# EAGLE design ShiftRegController (EAGLE 6.2)
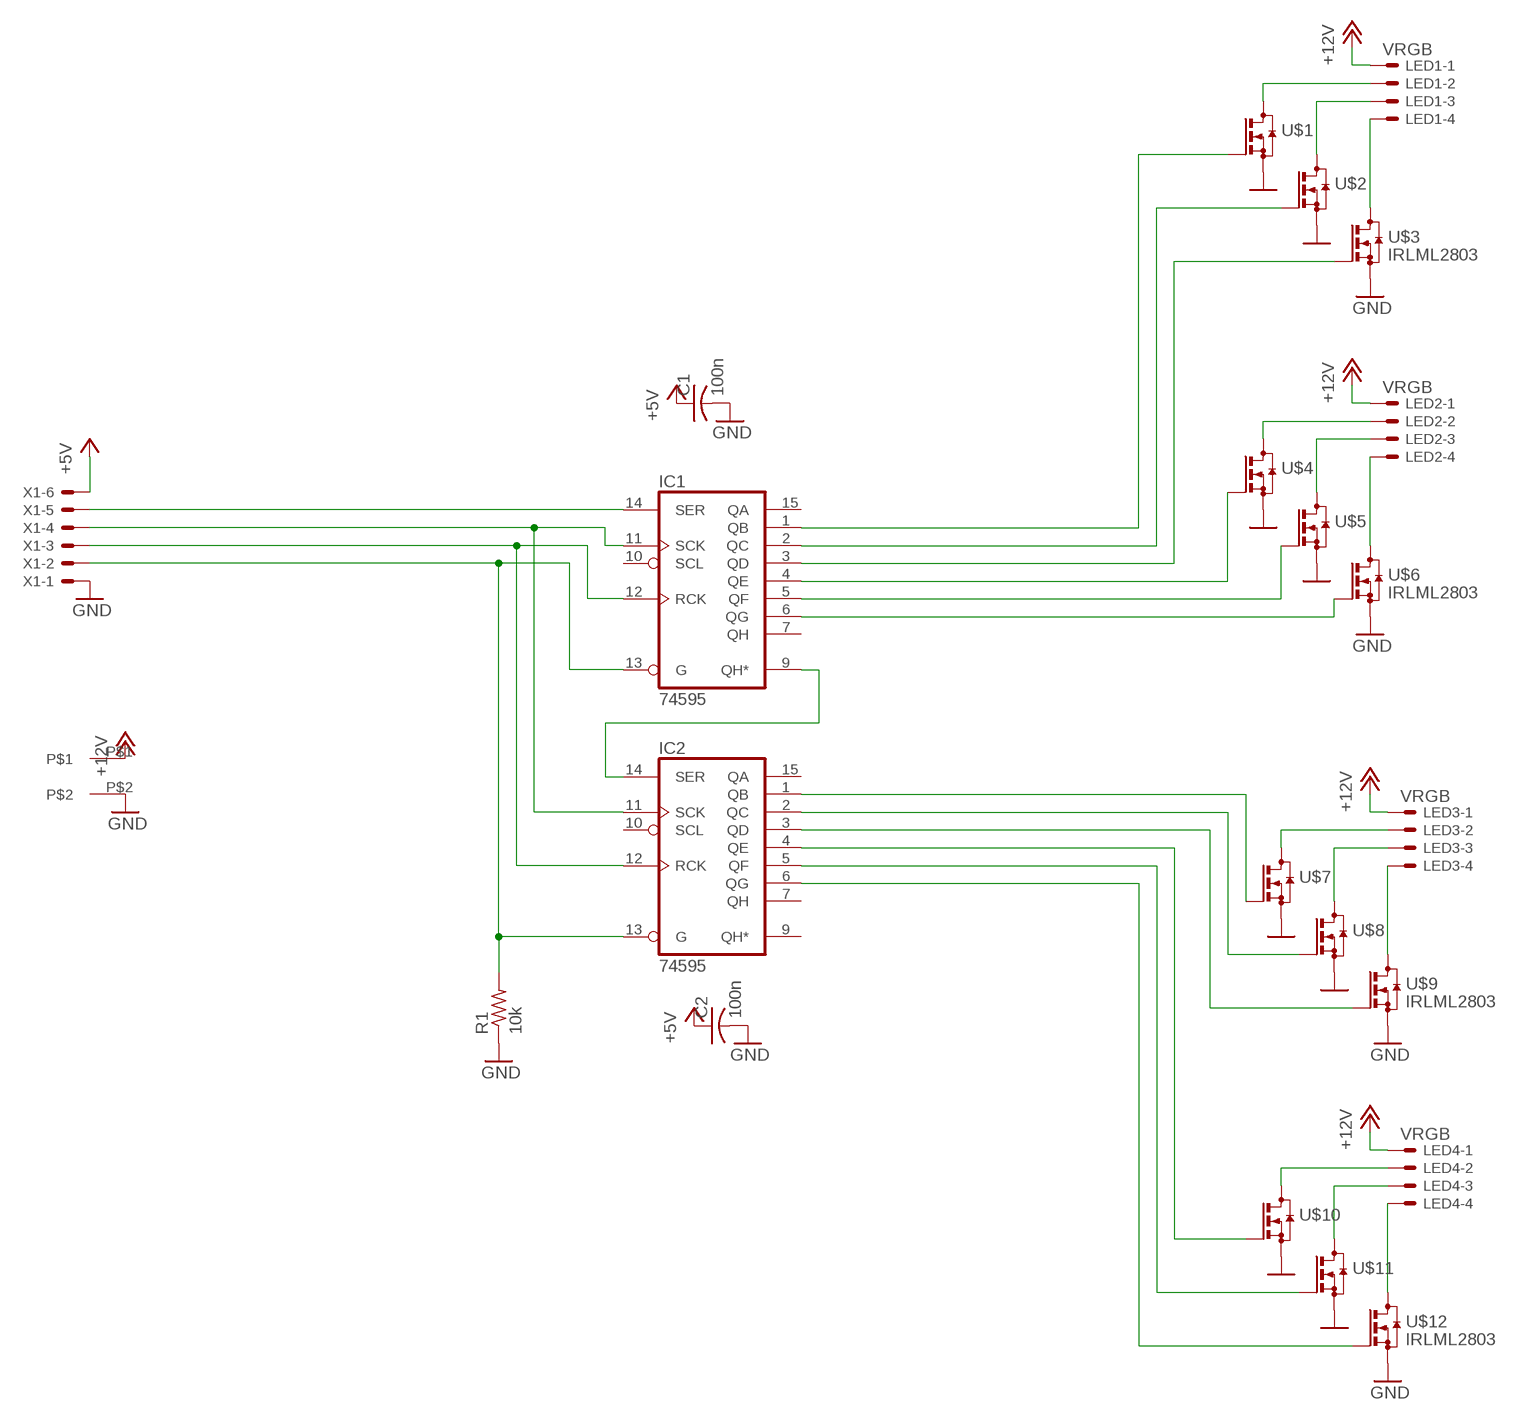
[diagram p0: schematic, sheet 1]

## Parts
C1  100n  C-USC0805  [C0805]
C2  100n  C-USC0805  [C0805]
IC1  74595  [TSSOP16]
IC2  74595  [TSSOP16]
LED1  VRGB  22-23-2041  [22-23-2041]
LED2  VRGB  22-23-2041  [22-23-2041]
LED3  VRGB  22-23-2041  [22-23-2041]
LED4  VRGB  22-23-2041  [22-23-2041]
R1  10k  R-US_R0805  [R0805]
U$1  IRLML2803  [SOT23]
U$2  IRLML2803  [SOT23]
U$3  IRLML2803  [SOT23]
U$4  IRLML2803  [SOT23]
U$5  IRLML2803  [SOT23]
U$6  IRLML2803  [SOT23]
U$7  IRLML2803  [SOT23]
U$8  IRLML2803  [SOT23]
U$9  IRLML2803  [SOT23]
U$10  IRLML2803  [SOT23]
U$11  IRLML2803  [SOT23]
U$12  IRLML2803  [SOT23]
U$13  DG301-5.0  [DG301-5.0]
X1  22-23-2061  [22-23-2061]

## Nets
+5V: C1.1 C2.1
+12V: LED1.1 LED2.1 LED3.1 LED4.1 U$13.P$1
GND: C1.2 C2.2 R1.1 U$1.2(S) U$2.2(S) U$3.2(S) U$4.2(S) U$5.2(S) U$6.2(S) U$7.2(S) U$8.2(S) U$9.2(S) U$10.2(S) U$11.2(S) U$12.2(S) U$13.P$2 X1.1
N$1: IC1.9(QH*) IC2.14(SER)
N$2: LED2.2 U$4.3(D)
N$3: LED1.2 U$1.3(D)
N$4: LED1.3 U$2.3(D)
N$5: LED1.4 U$3.3(D)
N$6: LED2.3 U$5.3(D)
N$7: LED2.4 U$6.3(D)
N$8: LED3.2 U$7.3(D)
N$9: LED3.3 U$8.3(D)
N$10: LED3.4 U$9.3(D)
N$11: LED4.2 U$10.3(D)
N$12: LED4.3 U$11.3(D)
N$13: LED4.4 U$12.3(D)
N$14: IC2.1(QB) U$7.1(G)
N$15: IC1.1(QB) U$1.1(G)
N$16: IC1.2(QC) U$2.1(G)
N$17: IC1.3(QD) U$3.1(G)
N$18: IC1.6(QG) U$6.1(G)
N$19: IC1.5(QF) U$5.1(G)
N$20: IC1.4(QE) U$4.1(G)
N$21: IC2.2(QC) U$8.1(G)
N$22: IC2.3(QD) U$9.1(G)
N$23: IC2.4(QE) U$10.1(G)
N$24: IC2.5(QF) U$11.1(G)
N$25: IC2.6(QG) U$12.1(G)
N$26: IC1.14(SER) X1.5
N$27: IC1.11(SCK) IC2.11(SCK) X1.4
N$28: IC1.12(RCK) IC2.12(RCK) X1.3
N$29: IC1.13(G) IC2.13(G) R1.2 X1.2
VCC: X1.6 ; supply symbol labelled +5V
Unconnected: IC1.7(QH) IC1.10(SCL) IC1.15(QA) IC2.7(QH) IC2.9(QH*) IC2.10(SCL) IC2.15(QA)

## Power pins joined to a net without a drawn wire
GND: IC1.8(GND) IC2.8(GND)
VCC: IC1.16(VCC) IC2.16(VCC)

## Library data of the parts
C1 C2 = resistor:C-US: CAPACITOR, American symbol
IC1 IC2 = RobThePyro:74*595: 8-bit SHIFT REGISTER, output latch
LED1-LED4 = con-molex:22-23-2041: .100" (2.54mm) Center Header - 4 Pin; MF: MOLEX; MPN: 22-23-2041; OC_FARNELL: 1462920; OC_NEWARK: 38C0355
R1 = resistor:R-US_: RESISTOR, American symbol
U$1-U$12 = RobThePyro:IRLML2803
U$13 = RobThePyro:DG301-5.0: Degson PCB strip connector
X1 = con-molex:22-23-2061: .100" (2.54mm) Center Header - 6 Pin; MF: MOLEX; MPN: 22-23-2061; OC_FARNELL: 1462922; OC_NEWARK: 27C1933

## Board
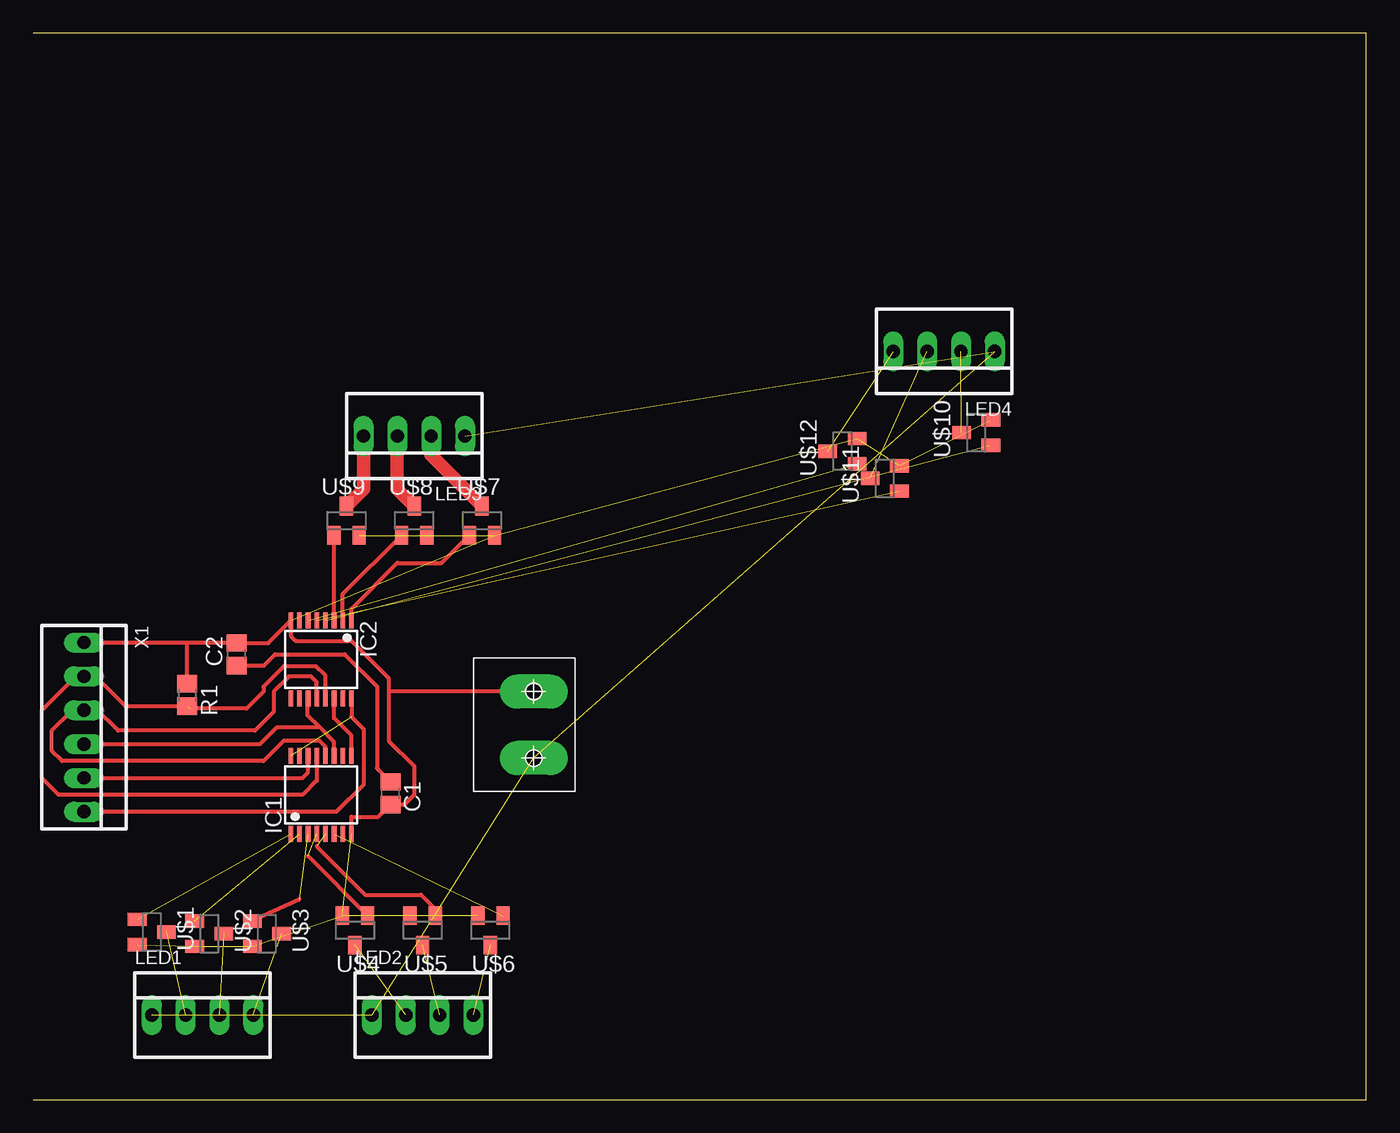
[diagram p1: board, top side]

Size 100 x 80 mm. Coordinates in mm from the lower left corner, seen from the top.
Outline: 0,0 100,0 100,80 0,80
Copper layers (1*16): Top 0.035mm / dielectric 1.5mm / Bottom 0.035mm
Design rules: minimum track width 10mil, minimum drill 24mil, track to track 8mil, track to pad 8mil, pad to pad 8mil, via to via 8mil, smd to smd 8mil, copper to edge 40mil, drill to drill 8mil, minimum pad ring 10mil, minimum via ring 8mil, stop-mask expansion 4mil, vias tented up to drill 0mil, thermal gap 10mil

### Footprints (pad centres in the part's own frame; a part is rotated, then mirrored left to right if it is on the bottom)
C0805 = smd 1.3 x 1.5: 1 -0.85,0; 2 0.85,0
TSSOP16 = smd 0.35 x 1.2: 1 -2.275,-2.925; 2 -1.625,-2.925; 3 -0.975,-2.925; 4 -0.325,-2.925; 5 0.325,-2.925; 6 0.975,-2.925; 7 1.625,-2.925; 8 2.275,-2.925; 9 2.275,2.925; 10 1.625,2.925; 11 0.975,2.925; 12 0.325,2.925; 13 -0.325,2.925; 14 -0.975,2.925; 15 -1.625,2.925; 16 -2.275,2.925
22-23-2041 = drill 1 long: 1 -3.81,0; 2 -1.27,0; 3 1.27,0; 4 3.81,0
R0805 = smd 1.3 x 1.5: 1 -0.85,0; 2 0.85,0
SOT23 = smd 1 x 1.4: 1 -0.95,-1.1; 2 0.95,-1.1; 3 0,1.1
DG301-5.0 = drill 1.3 pad 2.54 long: P$1 2.5,3.1; P$2 7.5,3.1 | hole 1.2: 2.5,3.1; 7.5,3.1
22-23-2061 = drill 1 long: 1 -6.35,0; 2 -3.81,0; 3 -1.27,0; 4 1.27,0; 5 3.81,0; 6 6.35,0

### Placement (x,y rotation side)
C1  26.8,22.99 270 top
C2  15.24,33.4 90 top
IC1  21.59,22.86 0 top
IC2  21.59,33.02 180 top
LED1  12.7,6.35 0 top
LED2  29.21,6.35 0 top
LED3  28.57,49.78 180 top
LED4  68.33,56.13 180 top
R1  11.56,30.35 270 top
U$1  8.89,12.57 270 top
U$2  13.21,12.45 270 top
U$3  17.53,12.45 270 top
U$4  24.13,12.7 180 top
U$5  29.21,12.7 180 top
U$6  34.29,12.7 180 top
U$7  33.66,43.43 0 top
U$8  28.57,43.43 0 top
U$9  23.5,43.43 0 top
U$10  70.74,50.04 90 top
U$11  63.88,46.61 90 top
U$12  60.71,48.64 90 top
U$13  40.64,23.11 90 top
X1  3.81,27.94 270 top

### Tracks (layer width: path | path; a pad name or v marks a point on that pad's centre or on a via)
+5V
  Top 0.305: C2.1 17.31,32.55 18.16,33.4 23.37,33.4 25.78,30.99 25.78,24.85 C1.1
+12V  (4 unrouted)
GND  (12 unrouted)
  Top 0.305: R1.1 11.56,34.29 | 11.56,34.29 15.46,34.29 C2.2 17.62,34.25 IC2.8 19.32,34.79 19.68,34.42 23.88,34.42 26.67,31.62 26.67,30.61 | X1.1 11.56,34.29 | IC1.8 23.86,21.2 23.88,21.21 25.87,21.21 C1.2 26.84,22.1 27.81,22.1 28.57,22.86 28.57,25.02 26.67,26.92 26.67,30.61 | U$13.P$2 26.68,30.61 26.67,30.61
N$1
  Top 0.305: IC1.9 23.88,25.8 23.88,27.3 22.57,28.62 IC2.14
N$2  (1 unrouted)
N$3  (1 unrouted)
N$4  (1 unrouted)
N$5  (1 unrouted)
N$6  (1 unrouted)
N$7  (1 unrouted)
N$8
  Top 1.016: LED3.2 29.84,48.34 U$7.3
N$9
  Top 1.016: LED3.3 27.3,45.8 U$8.3
N$10
  Top 1.016: LED3.4 24.77,45.8 U$9.3
N$11  (1 unrouted)
N$12  (1 unrouted)
N$13  (1 unrouted)
N$14
  Top 0.305: IC2.1 23.86,36.82 27.3,40.26 30.63,40.26 U$7.1
N$15  (1 unrouted)
N$16  (1 unrouted)
N$17  (1 unrouted)
  Top 0.305: 19.96,15.04 U$3.1
N$18  (1 unrouted)
N$19  (1 unrouted)
  Top 0.305: 21.27,18.99 24.89,15.37 29.08,15.37 30.1,14.35 30.1,13.86 U$5.1
N$20  (1 unrouted)
  Top 0.305: 20.61,18.27 U$4.1
N$21
  Top 0.305: IC2.2 23.21,37.92 U$8.1
N$22
  Top 0.305: U$9.1 22.55,35.97 IC2.3
N$23  (1 unrouted)
N$24  (1 unrouted)
N$25  (1 unrouted)
N$26
  Top 0.305: X1.5 20.19,24.13 20.61,24.55 IC1.14
N$27
  Top 0.305: IC1.11 22.57,26.84 21.46,27.94 | 21.46,27.94 20.57,28.83 20.57,30.05 IC2.11 | X1.4 17.02,26.67 18.29,27.94 21.46,27.94
N$28
  Top 0.305: IC1.12 21.91,26.47 21.46,26.92 18.8,26.92 17.27,25.4 2.16,25.4 1.4,26.16 1.4,27.69 2.92,29.21 X1.3 3.94,29.34 4.7,29.34 6.35,27.69 16.64,27.69 18.03,29.08 18.03,30.61 19.18,31.75 20.83,31.75 21.27,31.31 IC2.12
N$29  (1 unrouted)
  Top 0.305: IC1.13 21.27,23.93 20.19,22.86 1.91,22.86 0.64,24.13 0.64,29.21 3.17,31.75 X1.2 4.7,31.75 6.95,29.5 R1.2 | IC2.13 21.91,31.81 21.21,32.51 18.8,32.51 17.27,30.99 17.27,30.61 16,29.34 11.72,29.34
VCC  (1 unrouted)
  Top 0.305: IC2.16 23.86,28.71 24.77,27.81 24.77,23.62 22.73,21.59 X1.6